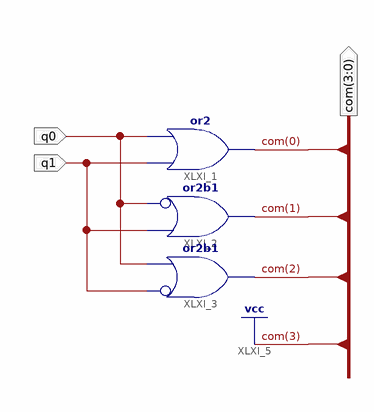
[diagram p0: schematic sheet 1]
// Xilinx ISE schematic Decoder.sch (spartan6) as structural Verilog: 3 symbols, 3 ports
module Decoder (
  input  q1,
  input  q0,
  output [3:0] com
);

  or XLXI_1 (com[0], q0, q1);
  or XLXI_2 (com[1], ~q0, q1);  // or2b1
  or XLXI_3 (com[2], ~q1, q0);  // or2b1

  assign com[3] = 1'b1;
endmodule
